# EAGLE design GPS_Logger (EAGLE 5.11)
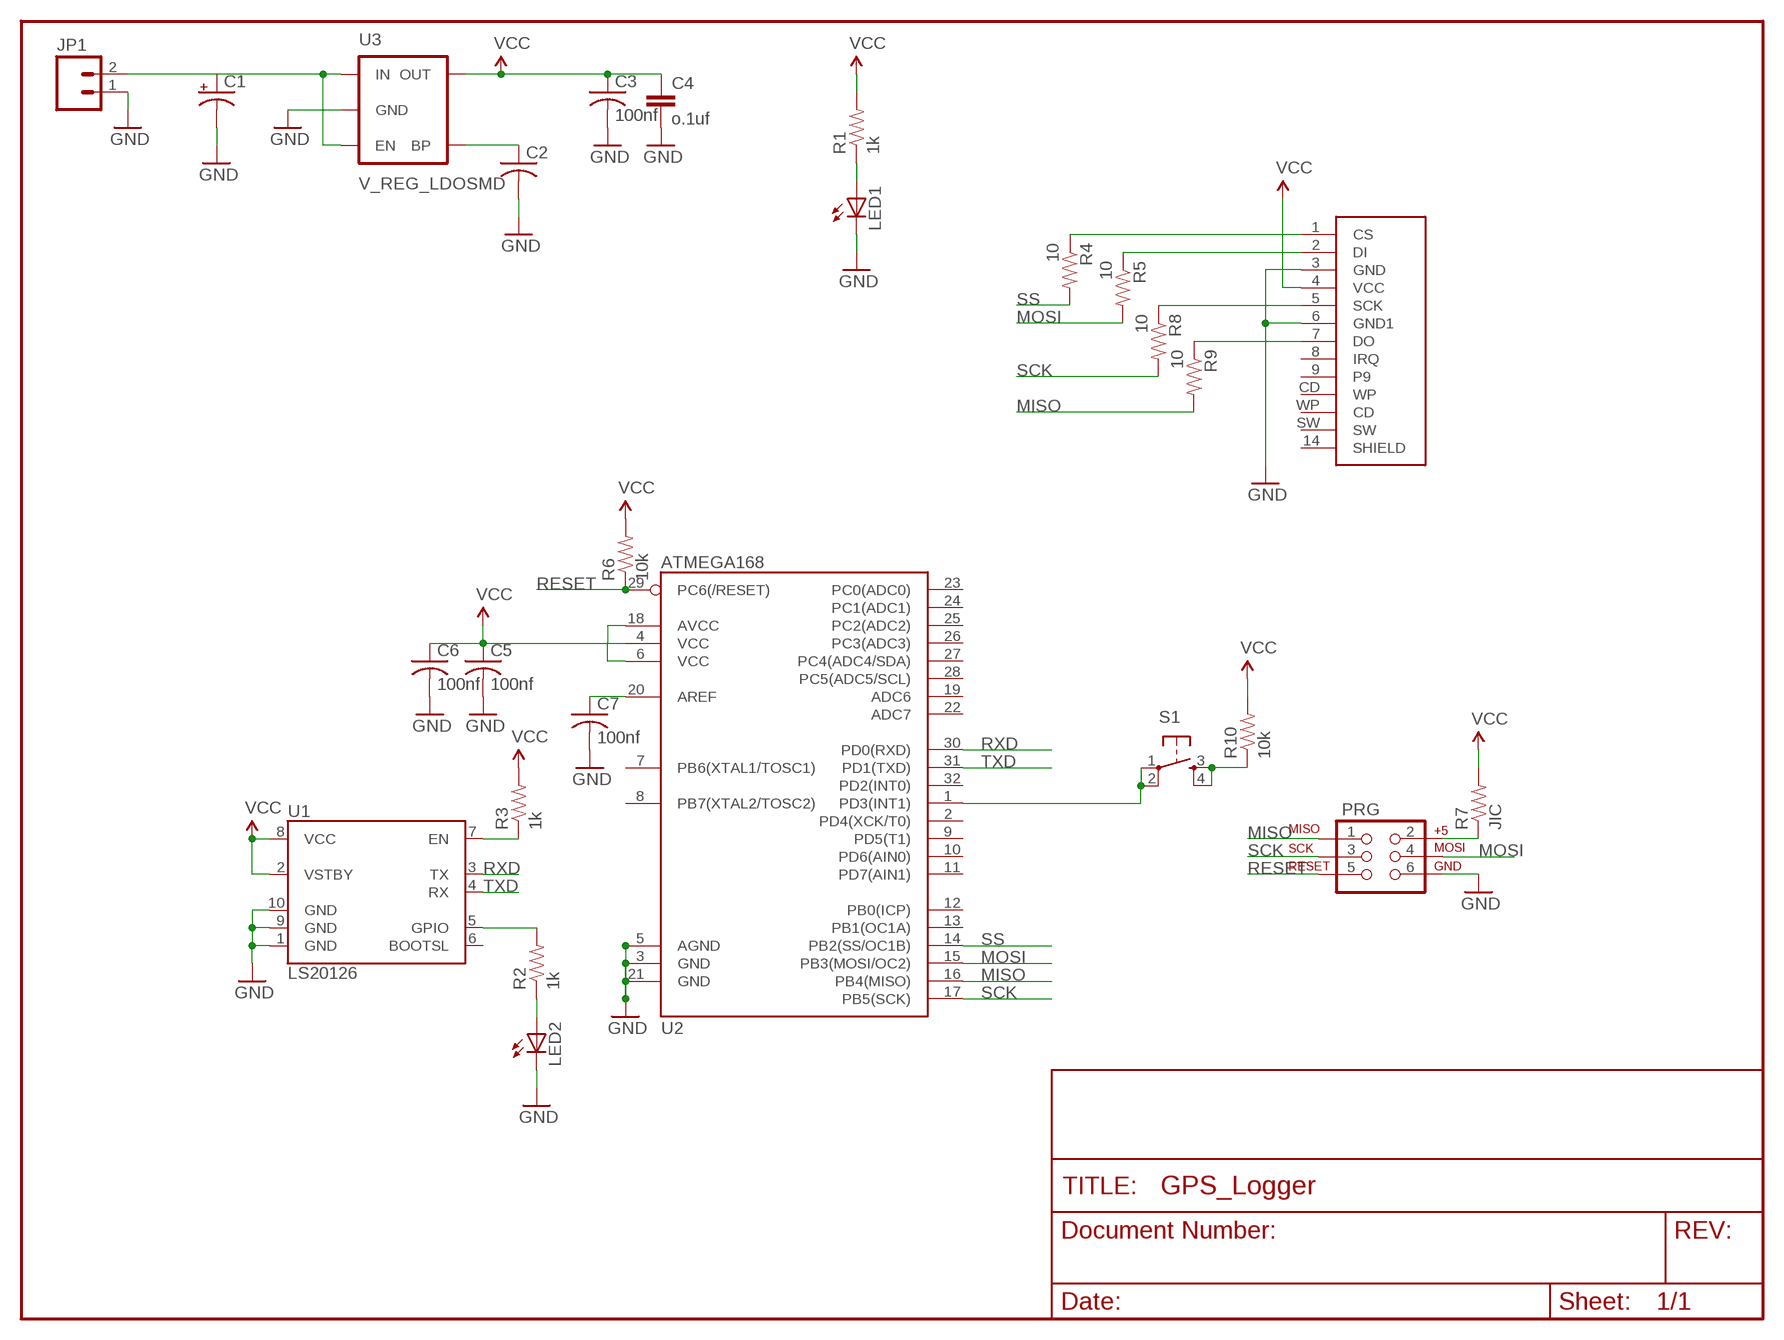
[diagram p0: schematic, sheet 1]

## Parts
C1  CAP_POLG  [PANASONIC_G]
C2  C-USC0603  [C0603]
C3  100nf  C-USC0603  [C0603]
C4  o.1uf  CAP1206  [1206]
C5  100nf  C-USC0603  [C0603]
C6  100nf  C-USC0603  [C0603]
C7  100nf  C-USC0603  [C0603]
JP1  M02-JST-2MM-SMT  [JST-2-SMD]
LED1  LEDCHIPLED_0603  [CHIPLED_0603]
LED2  LEDCHIPLED_0603  [CHIPLED_0603]
PRG  AVR_SPI_PRG_6PTH  [2X3]
R1  1k  RESISTOR0603-RES  [0603-RES]
R2  1k  RESISTOR0603-RES  [0603-RES]
R3  1k  RESISTOR0603-RES  [0603-RES]
R4  10  RESISTOR0603-RES  [0603-RES]
R5  10  RESISTOR0603-RES  [0603-RES]
R6  10k  RESISTOR0603-RES  [0603-RES]
R7  JIC  RESISTOR0603-RES  [0603-RES]
R8  10  RESISTOR0603-RES  [0603-RES]
R9  10  RESISTOR0603-RES  [0603-RES]
R10  10k  RESISTOR0603-RES  [0603-RES]
S1  TAC_SWITCHSMD  [TACTILE_SWITCH_SMD]
U1  LS20126  [LS20126]
U2  ATMEGA168  [TQFP32-08]
U3  V_REG_LDOSMD  [SOT23-5]
U$1  SD_CARD_SOCKETSD  [SD-MMC_SOCKET-PP]

## Nets
GND: C1.- C2.2 C3.2 C4.2 C5.2 C6.2 C7.2 JP1.1 LED1.C LED2.C PRG.6 U1.1(GND) U1.9(GND) U1.10(GND) U2.3(GND) U2.5(AGND) U2.21(GND) U3.2(GND) U$1.3(GND) U$1.6(GND1)
MISO: PRG.1 R9.2 U2.16(PB4(MISO))
MOSI: PRG.4 R5.2 U2.15(PB3(MOSI/OC2))
N$1: C1.+ JP1.2 U3.1(IN) U3.3(EN)
N$2: C2.1 U3.4(BP)
N$3: LED1.A R1.1
N$4: R4.1 U$1.1(CS)
N$5: LED2.A R2.1
N$6: R2.2 U1.5(GPIO)
N$7: R5.1 U$1.2(DI)
N$8: R8.1 U$1.5(SCK)
N$9: R3.1 U1.7(EN)
N$10: PRG.2 R7.1
N$11: R9.1 U$1.7(DO)
N$12: C7.1 U2.20(AREF)
N$13: S1.1 S1.2 U2.1(PD3(INT1))
N$14: R10.1 S1.3 S1.4
RESET: PRG.5 R6.1 U2.29(PC6(/RESET))
RXD: U1.3(TX) U2.30(PD0(RXD))
SCK: PRG.3 R8.2 U2.17(PB5(SCK))
SS: R4.2 U2.14(PB2(SS/OC1B))
TXD: U1.4(RX) U2.31(PD1(TXD))
VCC: C3.1 C4.1 C5.1 C6.1 R1.2 R3.2 R6.2 R7.2 R10.2 U1.2(VSTBY) U1.8(VCC) U2.4(VCC) U2.6(VCC) U2.18(AVCC) U3.5(OUT) U$1.4(VCC)
Unconnected: U1.6(BOOTSL) U2.2(PD4(XCK/T0)) U2.7(PB6(XTAL1/TOSC1)) U2.8(PB7(XTAL2/TOSC2)) U2.9(PD5(T1)) U2.10(PD6(AIN0)) U2.11(PD7(AIN1)) U2.12(PB0(ICP)) U2.13(PB1(OC1A)) U2.19(ADC6) U2.22(ADC7) U2.23(PC0(ADC0)) U2.24(PC1(ADC1)) U2.25(PC2(ADC2)) U2.26(PC3(ADC3)) U2.27(PC4(ADC4/SDA)) U2.28(PC5(ADC5/SCL)) U2.32(PD2(INT0)) U$1.8(IRQ) U$1.9 U$1.14(SHIELD) U$1.CD(WP) U$1.SW U$1.WP(CD)

## Library data of the parts
C1 = SparkFun:CAP_POL: Capacitor Polarized These are standard SMD and PTH capacitors. Normally 10uF, 47uF, and 100uF in electrolytic and tantalum varieties. Always verify the external diameter of the through hole cap, it varies with capacity, voltage, and manufacturer. The EIA devices should be standard.
C2 C3 C5-C7 = rcl:C-US: CAPACITOR, American symbol
C4 = SparkFun:CAP: Capacitor Standard 0603 ceramic capacitor, and 0.1" leaded capacitor.
JP1 = SparkFun:M02: Header 2 Standard 2-pin 0.1" header. Use with straight break away headers (SKU : PRT-00116), right angle break away headers (PRT-00553), swiss pins (PRT-00743), machine pins (PRT-00117), and female headers (PRT-00115). Molex polarized connector foot print use with SKU : PRT-08233 with associated crimp pins and housings.
LED1 LED2 = led:LED: LED OSRAM: - CHIPLED LG R971, LG N971, LY N971, LG Q971, LY Q971, LO R971, LY R971 LH N974, LH R974 LS Q976, LO Q976, LY Q976 LO Q996 - Hyper CHIPLED LW Q18S LB Q993, LB Q99A, LB R99A - SideLED LS A670, LO A670, LY A670, LG A670, LP A670 LB A673, LV A673, LT A673, LW A673 LH A674 LY A675 LS A676, LA A676, LO A676, LY A676, LW A676 LS A679, LY A679, LG A679 - Hyper Micro SIDELED® LS Y876, LA Y876, LO Y876, LY Y876 LT Y87S - SmartLED LW L88C, LW L88S LB L89C, LB L89S, LG L890 LS L89K, LO L89K, LY L89K LS L896, LA L896, LO L896, LY L896 - TOPLED LS T670, LO T670, LY T670, LG T670, LP T670 LSG T670, LSP T670, LSY T670, LOP T670, LYG T670 LG T671, LOG T671, LSG T671 LB T673, LV T673, LT T673, LW T673 LH T674 LS T676, LA T676, LO T676, LY T676, LB T676, LH T676, LSB T676, LW T676 LB T67C, LV T67C, LT T67C, LS T67K, LO T67K, LY T67K, LW E67C LS E67B, LA E67B, LO E67B, LY E67B, LB E67C, LV E67C, LT E67C LW T67C LS T679, LY T679, LG T679 LS T770, LO T770, LY T770, LG T770, LP T770 LB T773, LV T773, LT T773, LW T773 LH T774 LS E675, LA E675, LY E675, LS T675 LS T776, LA T776, LO T776, LY T776, LB T776 LHGB T686 LT T68C, LB T68C - Hyper Mini TOPLED® LB M676 - Mini TOPLED Santana® LG M470 LS M47K, LO M47K, LY M47K Source: http://www.osram.convergy.de LUXEON: - LUMILED® LXK2-PW12-R00, LXK2-PW12-S00, LXK2-PW14-U00, LXK2-PW14-V00 LXK2-PM12-R00, LXK2-PM12-S00, LXK2-PM14-U00 LXK2-PE12-Q00, LXK2-PE12-R00, LXK2-PE12-S00, LXK2-PE14-T00, LXK2-PE14-U00 LXK2-PB12-K00, LXK2-PB12-L00, LXK2-PB12-M00, LXK2-PB14-N00, LXK2-PB14-P00, LXK2-PB14-Q00 LXK2-PR12-L00, LXK2-PR12-M00, LXK2-PR14-Q00, LXK2-PR14-R00 LXK2-PD12-Q00, LXK2-PD12-R00, LXK2-PD12-S00 LXK2-PH12-R00, LXK2-PH12-S00 LXK2-PL12-P00, LXK2-PL12-Q00, LXK2-PL12-R00 Source: www.luxeon.com KINGBRIGHT: KA-3528ASYC Source: www.kingbright.com
PRG = SparkFun:AVR_SPI_PRG_6: AVR ISP 6 Pin This is the reduced ISP connector for AVR programming. Common on Arduino. This footprint will take up less PCB space and can be used with a 10-pin to 6-pin adapter such as SKU: BOB-08508
R1-R10 = SparkFun:RESISTOR: Resistor Basic schematic elements and footprints for 0603, 1206, and PTH resistors.
S1 = SparkFun:TAC_SWITCH: Momentary Switch Button commonly used for reset or general input. Spark Fun Electronics SKU : COM-00097
U1 = SparkFun:LS20126: LS20126 20-Channel GPS Module SparkFun SKU# GPS-09838 The LOCOSYS LS20126 GPS smart antenna module is a high sensitivity, low power, SMD type, 20 channels with built-in magnetic sensor, 3-axial acceleration sensor L1 GPS receiver and 10mm patch antenna designed for portable applications.
U2 = SparkFun:ATMEGA168
U3 = SparkFun:V_REG_LDO: Voltage Regulator LDO Standard 150mA LDO voltage regulator in SOT-23 layout. Micrel part MIC5205. BP (by-pass) pin is used to lower output noise with 470pF cap.
U$1 = SparkFun:SD_CARD_SOCKET: SD/MMC Socket Media socket for SD and MMC cards. Push-push type. Schematic element and footprint production proven. Spark Fun Electronics SKU : PRT-00136

## Board
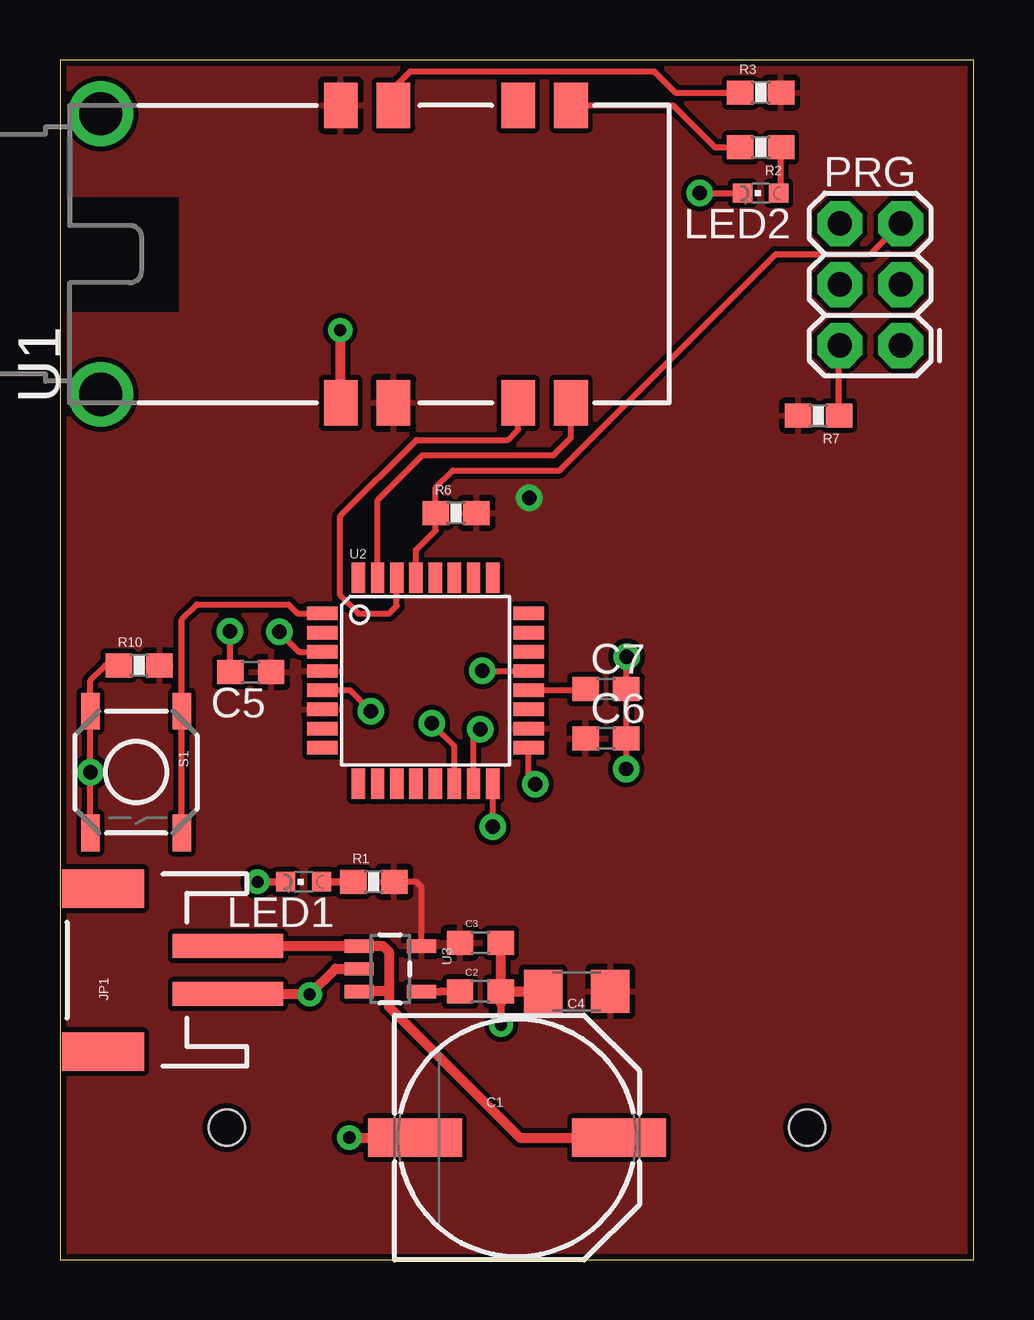
[diagram p1: board, top side]
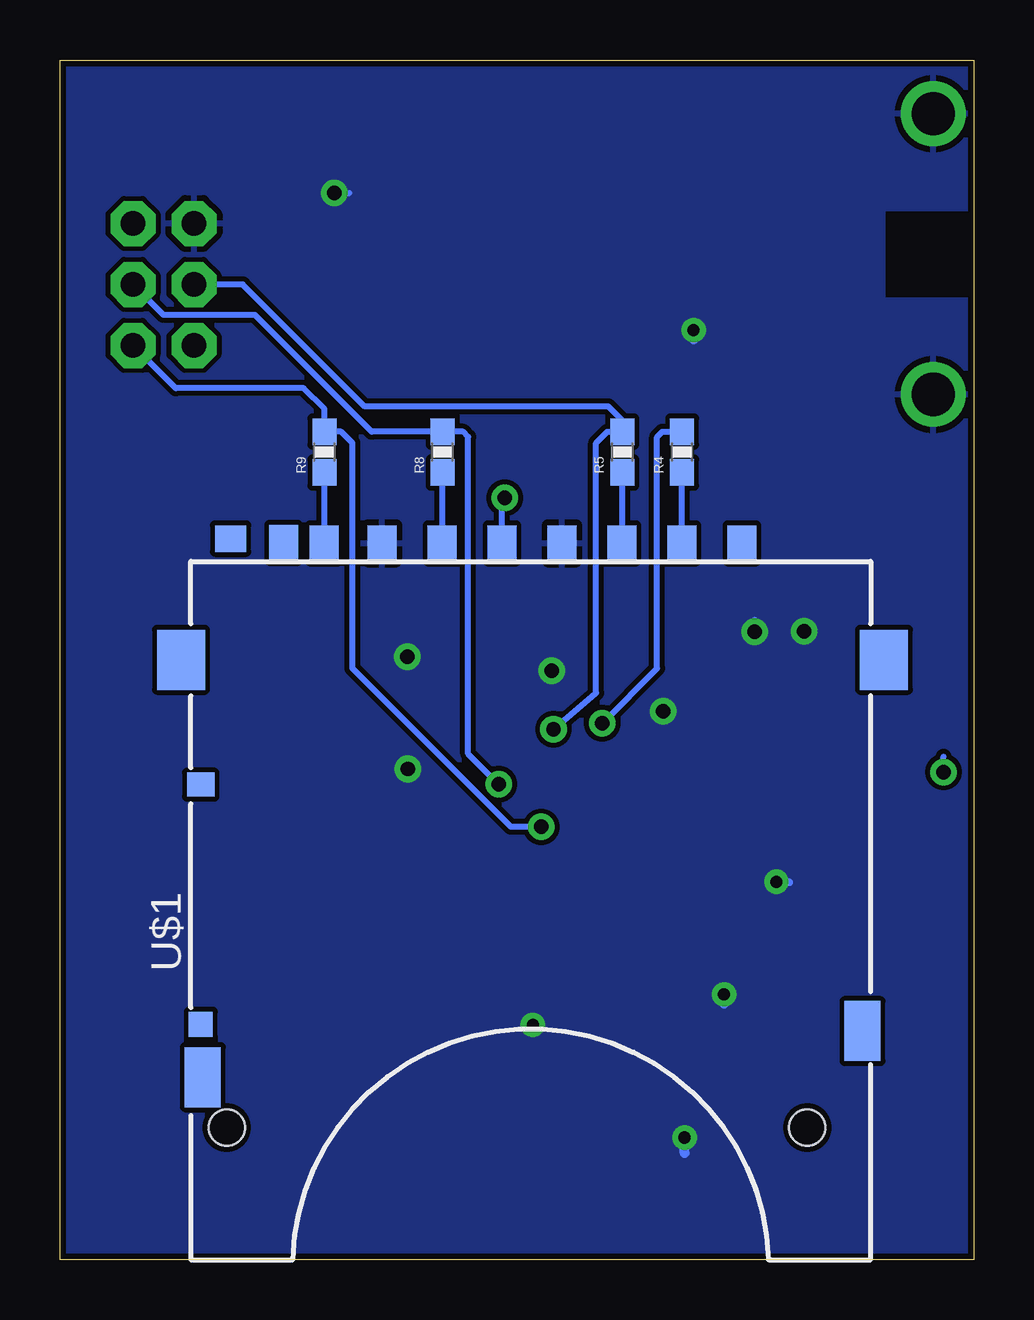
[diagram p2: board, bottom side, seen from below]

Size 38.1 x 50 mm. Coordinates in mm from the lower left corner, seen from the top.
Outline: 0,0 38.1,0 38.1,50 0,50 0,0
Copper layers (1*16): Top 0.035mm / dielectric 1.5mm / Bottom 0.035mm
Design rules "SparkFun *": minimum track width 8mil, minimum drill 0.5029mm, track to track 8mil, track to pad 8mil, pad to pad 8mil, via to via 8mil, smd to smd 8mil, copper to edge 10mil, drill to drill 8mil, minimum pad ring 12mil, minimum via ring 10mil, stop-mask expansion 4mil, vias tented up to drill 25mil, thermal gap 10mil

### Footprints (pad centres in the part's own frame; a part is rotated, then mirrored left to right if it is on the bottom)
PANASONIC_G = smd 3.9 x 1.6: + 4.25,0; - -4.25,0
C0603 = smd 1.1 x 1: 1 -0.85,0; 2 0.85,0
1206 = smd 1.6 x 1.8: 1 -1.4,0; 2 1.4,0
JST-2-SMD = smd 1 x 4.6: 1 -1,-3.7; 2 1,-3.7 | smd 1.6 x 3.4: NC1 -3.4,1.5; NC2 3.4,1.5
CHIPLED_0603 = smd 0.8 x 0.8: A 0,-0.75; C 0,0.75
2X3 = drill 1.016 pad 1.88 octagon: 1 0,0; 2 0,2.54; 3 2.54,0; 4 2.54,2.54; 5 5.08,0; 6 5.08,2.54
0603-RES = smd 1.1 x 1: 1 -0.85,0; 2 0.85,0
TACTILE_SWITCH_SMD = smd 1.524 x 0.762: 1 -2.54,1.905; 2 2.54,1.905; 3 -2.54,-1.905; 4 2.54,-1.905
LS20126 = smd 1.9 x 1.4: 1 -6.2,13.7; 2 -6.2,11.5; 3 -6.2,6.3; 4 -6.2,4.1; 5 6.2,4.1; 6 6.2,6.3; 7 6.2,11.5; 8 6.2,13.7 | drill 1.8 round: 9 5.85,23.7; 10 -5.85,23.7
TQFP32-08 = smd 1.27 x 0.559: 1 -4.293,2.8; 2 -4.293,2; 3 -4.293,1.2; 4 -4.293,0.4; 5 -4.293,-0.4; 6 -4.293,-1.2; 7 -4.293,-2; 8 -4.293,-2.8; 17 4.293,-2.8; 18 4.293,-2; 19 4.293,-1.2; 20 4.293,-0.4; 21 4.293,0.4; 22 4.293,1.2; 23 4.293,2; 24 4.293,2.8 | smd 0.559 x 1.27: 9 -2.8,-4.293; 10 -2,-4.293; 11 -1.2,-4.293; 12 -0.4,-4.293; 13 0.4,-4.293; 14 1.2,-4.293; 15 2,-4.293; 16 2.8,-4.293; 25 2.8,4.293; 26 2,4.293; 27 1.2,4.293; 28 0.4,4.293; 29 -0.4,4.293; 30 -1.2,4.293; 31 -2,4.293; 32 -2.8,4.293
SOT23-5 = smd 0.55 x 1.2: 1 -0.95,-1.3; 2 0,-1.3; 3 0.95,-1.3; 4 0.95,1.3; 5 -0.95,1.3
SD-MMC_SOCKET-PP = smd 1.2 x 1.5: 1 6.88,29.85; 2 4.38,29.85; 3 1.88,29.85; 4 -0.62,29.85; 5 -3.12,29.85; 6 -5.62,29.85; 7 -8.04,29.85; 8 -9.728,29.87; 9 9.38,29.85 | smd 1.5 x 2.5: 12 -13.1,7.6; 13 14.402,9.525 | smd 2 x 2.5: 14 -14,25; 15 15.3,25 | smd 1.15 x 1: CD -13.18,19.8 | smd 1.3 x 1.1: SW -11.938,30.048 | smd 1 x 1.05: WP -13.18,9.8 | hole 1.5: -12.1,5.5; 12.1,5.5

### Placement (x,y rotation side)
C1  19.05,5.08 0 top
C2  17.53,11.18 0 top
C3  17.53,13.21 0 top
C4  21.54,11.18 180 top
C5  7.95,24.49 180 top
C6  22.76,21.72 0 top
C7  22.76,23.77 0 top
JP1  3.3,12.06 90 top
LED1  10.16,15.75 90 top
LED2  29.21,44.45 90 top
PRG  35.05,38.1 90 top
R1  13.08,15.75 0 top
R2  29.21,46.35 180 top
R3  29.21,48.64 0 top
R4  12.17,33.66 90 bottom
R5  14.66,33.66 90 bottom
R6  16.51,31.11 0 top
R7  31.62,35.18 180 top
R8  22.15,33.66 90 bottom
R9  27.08,33.66 90 bottom
R10  3.3,24.77 0 top
S1  3.17,20.32 270 top
U1  25.4,41.91 90 top
U2  15.24,24.13 0 top
U3  13.77,12.12 270 top
U$1  19.05,0 0 bottom

### Tracks (layer width: path | path; a pad name or v marks a point on that pad's centre or on a via)
GND  (via drill 0.5, 0.51, 0.6)
  Top 0.254: C5.2 7.1,25.67 v7.09,26.19 | U2.3 9.98,25.33 v9.14,26.16 | U2.5 12.08,23.73 v12.95,22.86 | v23.6,20.45 v23.61,20.46 C6.2 C7.2 23.61,25.11 v23.62,25.12 | U2.21 v17.61,24.53 v17.6,24.54 | v26.67,44.45 LED2.C
  Top 0.305: 18.38,10.12 18.38,10.67 | LED1.C v8.23,15.75
  Top 0.406: JP1.1 10.4,11.06 v10.41,11.05 11.48,12.12 U3.2 | v12.06,5.08 C1.- | v18.39,9.78 18.38,10.12 | U1.1 11.7,38.75 v11.68,38.73 | 18.38,10.67 C2.2 | C2.2 C3.2 | C2.2 C4.2
  Bottom 0.254: v7.09,26.19 7.09,26.24 7.11,26.26 | v9.14,26.16 9.14,26.67 | v12.95,22.86 12.95,22.61 | 23.6,20.07 v23.6,20.45 | v23.62,25.12 23.62,25.32 | v17.6,24.54 17.6,24.84 17.58,24.87 | v26.67,44.45 26.04,44.45
  Bottom 0.305: v8.23,15.75 7.72,15.75 7.7,15.72
  Bottom 0.406: v10.41,11.05 10.41,10.67 | 12.06,4.45 v12.06,5.08 | v18.39,9.78 18.29,9.53 | v11.68,38.73 11.68,38.35
  pour Bottom: 38.48,0 38.1,50 0,50 0,43.8 3.81,43.8 3.81,39.99 0,39.99 0,0
MISO  (via drill 0.6)
  Top 0.254: v18.03,18.03 U2.16
  Bottom 0.254: PRG.1 33.27,36.32 27.94,36.32 27.08,35.46 R9.2 26.38,34.51 25.91,34.04 25.91,24.64 19.3,18.03 v18.03,18.03
MOSI  (via drill 0.6)
  Top 0.254: U2.15 17.24,21.81 v17.53,22.1
  Bottom 0.254: PRG.4 30.48,40.64 25.4,35.56 15.24,35.56 14.66,34.98 R5.2 15.28,34.51 15.75,34.04 15.75,23.62 v17.53,22.1
N$1
  Top 0.406: JP1.2 U3.1 13.48,13.07 13.72,12.83 13.72,11.18 | U3.3 13.72,11.18 | C1.+ 19.18,5.08 13.72,10.54 13.72,11.18
N$2
  Top 0.305: U3.4 15.87,11.17 15.88,11.18 C2.1
N$3
  Top 0.305: LED1.A R1.1
N$4
  Bottom 0.254: U$1.1 R4.1
  Bottom 0.406: U$1.1
N$5
  Top 0.254: R2.1 30.06,44.55 LED2.A
N$6
  Top 0.254: U1.5 25.55,48.11 27.3,46.35 R2.2
N$7
  Bottom 0.254: 14.66,29.86 R5.1
  Bottom 0.406: U$1.2 14.66,29.86
N$8
  Bottom 0.254: 22.15,29.87 R8.1
  Bottom 0.406: U$1.5 22.15,29.87
N$9
  Top 0.254: R3.1 25.65,48.64 24.77,49.53 14.61,49.53 13.97,48.9 13.97,48.18 U1.7
N$10
  Top 0.254: R7.1 32.47,38.06 PRG.2
N$11
  Bottom 0.254: 27.08,29.86 R9.1
  Bottom 0.406: U$1.7 27.08,29.86
N$12
  Top 0.254: U2.20 21.86,23.73 C7.1
N$13
  Top 0.254: U2.1 9.9,26.93 9.53,27.3 5.71,27.3 5.08,26.67 S1.1 S1.2
N$14  (via drill 0.6)
  Top 0.254: S1.4 v1.27,20.32 S1.3 1.27,24.13 1.91,24.77 R10.1
  Bottom 0.254: v1.27,20.32 1.27,20.95
RESET
  Top 0.254: U2.29 14.84,29.57 15.66,30.39 R6.1 15.66,32.17 16.38,32.89 20.83,32.89 29.84,41.91 33.78,41.91 PRG.5
RXD
  Top 0.254: U2.30 14.04,27.25 13.72,26.92 12.45,26.92 11.68,27.69 11.68,30.99 14.86,34.16 18.67,34.16 19.1,34.59 U1.3
SCK  (via drill 0.6)
  Top 0.254: U2.17 19.53,20.09 v19.81,19.81
  Bottom 0.254: PRG.3 33.78,39.37 29.97,39.37 25.11,34.51 R8.2 21.3,34.51 21.08,34.29 21.08,21.08 v19.81,19.81
SS  (via drill 0.6)
  Top 0.254: U2.14 16.44,21.41 v15.49,22.35
  Bottom 0.254: R4.2 12.99,34.51 13.21,34.29 13.21,24.64 v15.49,22.35
TXD
  Top 0.254: U1.4 21.3,34.25 20.57,33.53 15.11,33.53 13.24,31.66 U2.31
VCC  (via drill 0.6)
  Top 0.254: U3.5 15.07,15.54 14.86,15.75 R1.2 | v19.56,31.75 19.56,31.5
  Bottom 0.254: U$1.4 19.67,31.64 v19.56,31.75
  pour Top: 0,0 38.1,0 38.1,50 0,50 0,44.44 5.08,44.44 5.08,39.35 0,39.35